# EAGLE schematic SensorBoard (EAGLE 6.5.0)

## Sheet 1 of 4
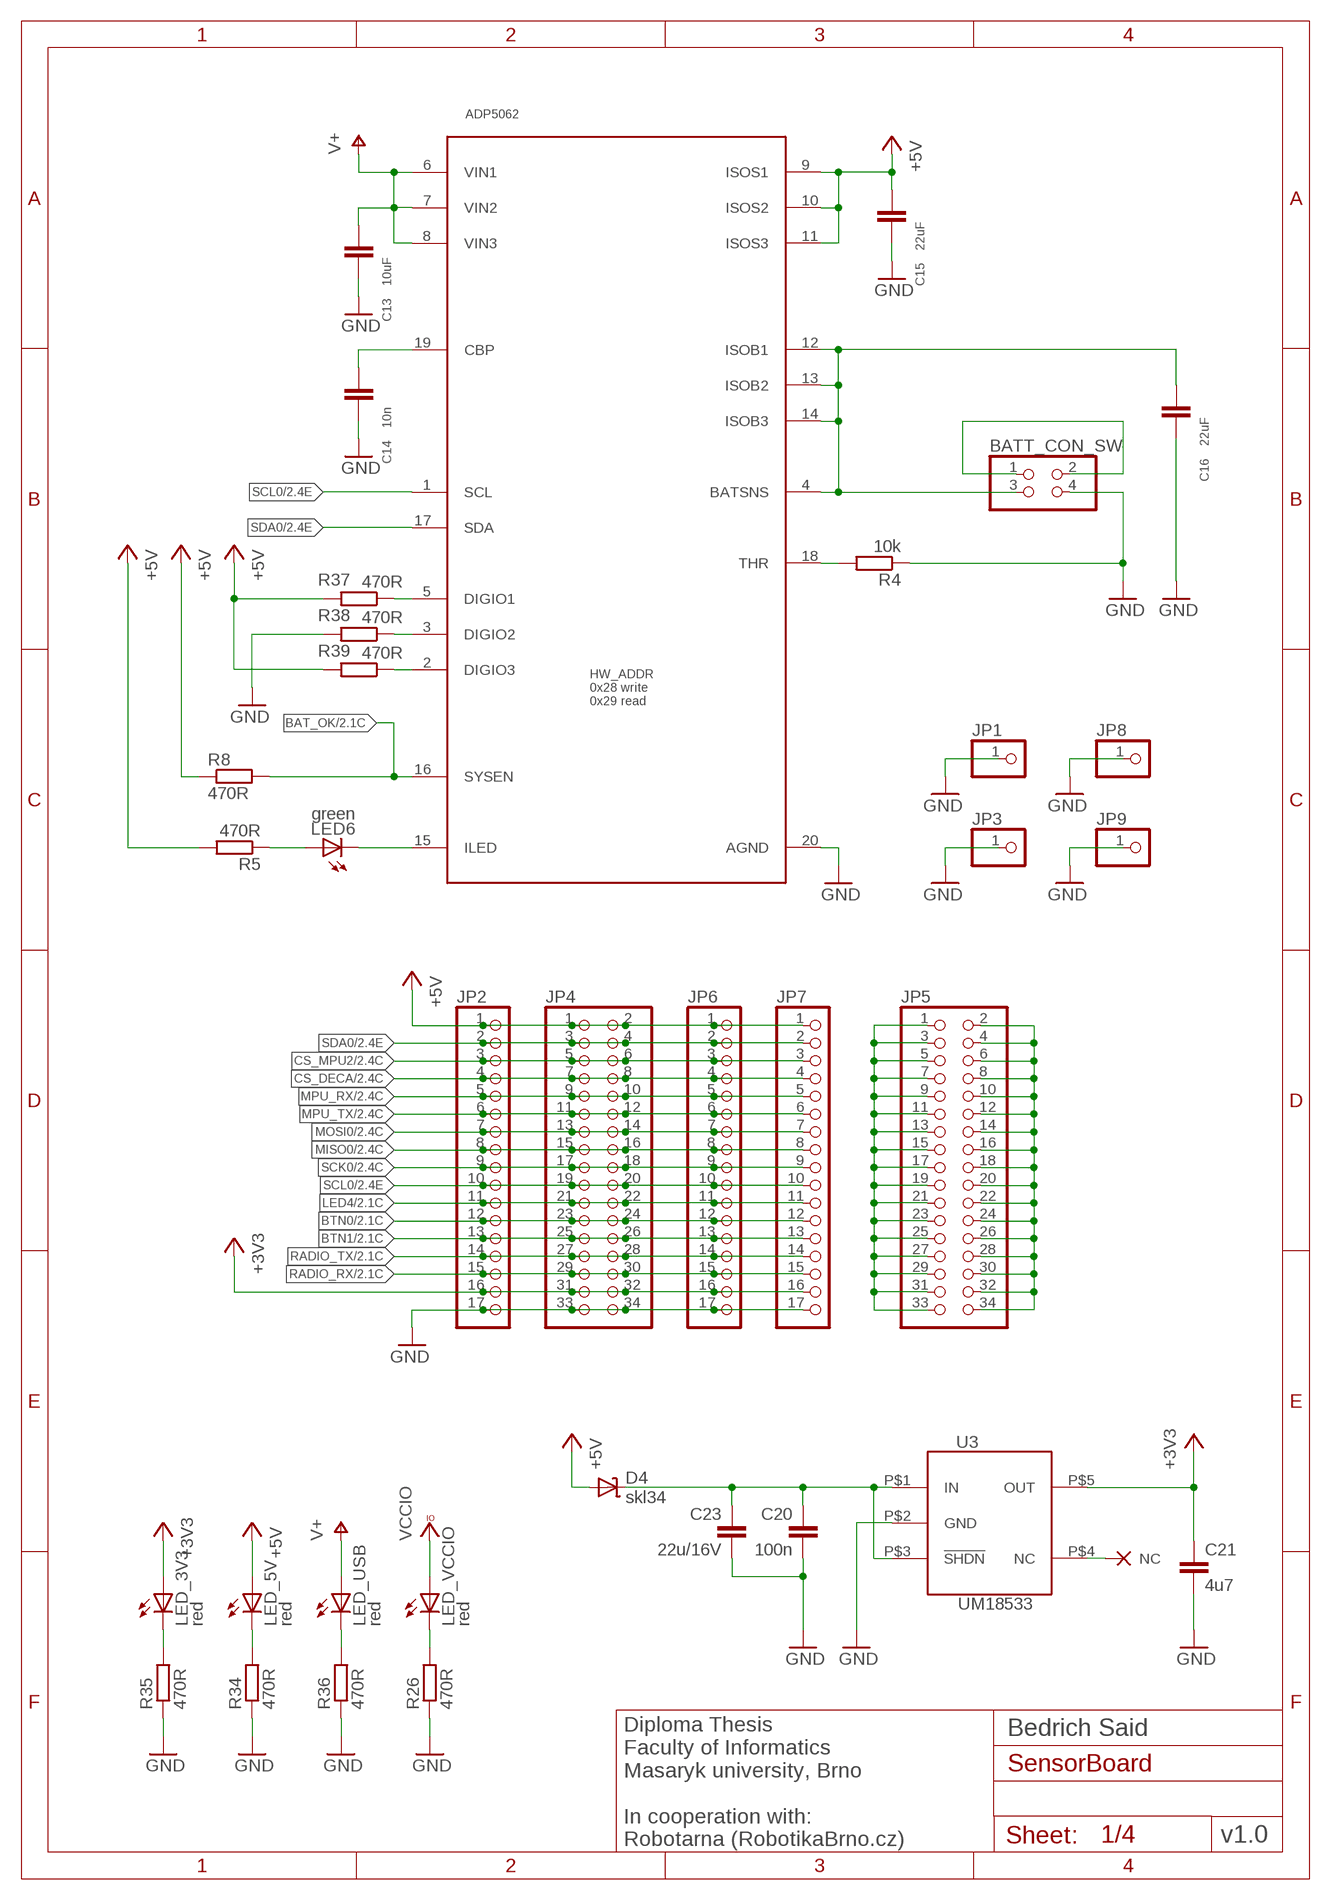
[diagram p0: schematic, sheet 1]

### Parts
BATT_CON_SW  PINHD-2X2  [2X02]
C13  10uF  C-EUC1206  [C1206]
C14  10n  C-EUC0603  [C0603]
C15  22uF  C-EUC1206  [C1206]
C16  22uF  C-EUC1206  [C1206]
C20  100n  C-EUC0603  [C0603]
C21  4u7  C-EUC0603  [C0603]
C23  22u/16V  C-EUC1206  [C1206]
CHARGER  ADP5062  [QFN50P400X400X80-21N]
D4  skl34  SHOTTKY-SOD123  [SOD123]
JP1  PINHD-1X1  [1X01]
JP2  PINHD-1X17  [1X17]
JP3  PINHD-1X1  [1X01]
JP4  PINHD-2X17  [2X17]
JP5  PINHD-2X17  [2X17]
JP6  PINHD-1X17  [1X17]
JP7  PINHD-1X17  [1X17]
JP8  PINHD-1X1  [1X01]
JP9  PINHD-1X1  [1X01]
LED6  green  LEDCHIPLED_0603  [CHIPLED_0603]
LED_3V3  red  LEDCHIPLED_0603  [CHIPLED_0603]
LED_5V  red  LEDCHIPLED_0603  [CHIPLED_0603]
LED_USB  red  LEDCHIPLED_0603  [CHIPLED_0603]
LED_VCCIO  red  LEDCHIPLED_0603  [CHIPLED_0603]
NC8  NC  (no package)
R4  10k  R-EU_R0603  [R0603]
R5  470R  R-EU_R0603  [R0603]
R8  470R  R-EU_R0603  [R0603]
R26  470R  R-EU_R0603  [R0603]
R34  470R  R-EU_R0603  [R0603]
R35  470R  R-EU_R0603  [R0603]
R36  470R  R-EU_R0603  [R0603]
R37  470R  R-EU_R0603  [R0603]
R38  470R  R-EU_R0603  [R0603]
R39  470R  R-EU_R0603  [R0603]
U3  UM18533  UM185XX  [SOT23-5]

### Nets
5V->3V3: C20.1 C23.1 D4.C U3.P$1(IN) U3.P$3(!SHDN)
+3V3: C21.1 JP2.16 JP4.31 JP4.32 JP6.16 JP7.16 LED_3V3.A U3.P$5(OUT) ; also sheet 2,3,4
+5V: C15.1 CHARGER.9(ISOS1) CHARGER.10(ISOS2) CHARGER.11(ISOS3) D4.A JP2.1 JP4.1 JP4.2 JP6.1 JP7.1 LED_5V.A R5.2 R8.1 R37.2 R39.2 ; also sheet 3
BAT_OK: CHARGER.16(SYSEN) R8.2 ; also sheet 2
BTN0: JP2.12 JP4.23 JP4.24 JP6.12 JP7.12 ; also sheet 2
BTN1: JP2.13 JP4.25 JP4.26 JP6.13 JP7.13 ; also sheet 2
CS_DECA: JP2.4 JP4.7 JP4.8 JP6.4 JP7.4 ; also sheet 2,4
CS_MPU2: JP2.3 JP4.5 JP4.6 JP6.3 JP7.3 ; also sheet 2,3
GND: BATT_CON_SW.4 C13.2 C14.2 C15.2 C16.2 C20.2 C21.2 C23.2 CHARGER.20(AGND) JP1.1 JP2.17 JP3.1 JP4.33 JP4.34 JP6.17 JP7.17 JP8.1 JP9.1 R4.1 R26.1 R34.1 R35.1 R36.1 R38.2 U3.P$2(GND) ; also sheet 2,3,4
LED4: JP2.11 JP4.21 JP4.22 JP6.11 JP7.11 ; also sheet 2
LED_3V3: LED_VCCIO.C R26.2
LED_3V3_USB: LED_USB.C R36.2
LED_3V3_USB1: LED_3V3.C R35.2
LED_3V4: LED_5V.C R34.2
MISO0: JP2.8 JP4.15 JP4.16 JP6.8 JP7.8 ; also sheet 2,3,4
MOSI0: JP2.7 JP4.13 JP4.14 JP6.7 JP7.7 ; also sheet 2,3,4
MPU_RX: JP2.5 JP4.9 JP4.10 JP6.5 JP7.5 ; also sheet 2,3
MPU_TX: JP2.6 JP4.11 JP4.12 JP6.6 JP7.6 ; also sheet 2,3
N$3: JP5.1 JP5.3 JP5.5 JP5.7 JP5.9 JP5.11 JP5.13 JP5.15 JP5.17 JP5.19 JP5.21 JP5.23 JP5.25 JP5.27 JP5.29 JP5.31 JP5.33
N$8: BATT_CON_SW.3 C16.1 CHARGER.4(BATSNS) CHARGER.12(ISOB1) CHARGER.13(ISOB2) CHARGER.14(ISOB3)
N$9: BATT_CON_SW.1 BATT_CON_SW.2
N$10: CHARGER.18(THR) R4.2
N$14: CHARGER.15(ILED) LED6.C
N$17: C14.1 CHARGER.19(CBP)
N$18: LED6.A R5.1
N$20: CHARGER.5(DIGIO1) R37.1
N$21: CHARGER.3(DIGIO2) R38.1
N$22: CHARGER.2(DIGIO3) R39.1
N$30: JP5.2 JP5.4 JP5.6 JP5.8 JP5.10 JP5.12 JP5.14 JP5.16 JP5.18 JP5.20 JP5.22 JP5.24 JP5.26 JP5.28 JP5.30 JP5.32 JP5.34
RADIO_RX: JP2.15 JP4.29 JP4.30 JP6.15 JP7.15 ; also sheet 2,3
RADIO_TX: JP2.14 JP4.27 JP4.28 JP6.14 JP7.14 ; also sheet 2,3
SCK0: JP2.9 JP4.17 JP4.18 JP6.9 JP7.9 ; also sheet 2,3,4
SCL0: CHARGER.1(SCL) JP2.10 JP4.19 JP4.20 JP6.10 JP7.10 ; also sheet 2,3
SDA0: CHARGER.17(SDA) JP2.2 JP4.3 JP4.4 JP6.2 JP7.2 ; also sheet 2,3
U2_NC1: NC8.NC U3.P$4(NC)
V+: C13.1 CHARGER.6(VIN1) CHARGER.7(VIN2) CHARGER.8(VIN3) LED_USB.A ; also sheet 2
VCCIO: LED_VCCIO.A ; also sheet 2

### Notes on the sheet
- HW_ADDR
  0x28 write
  0x29 read
- Bedrich Said
- v1.0
- Diploma Thesis
  Faculty of Informatics
  Masaryk university, Brno
  
  In cooperation with:
  Robotarna (RobotikaBrno.cz)

## Sheet 2 of 4
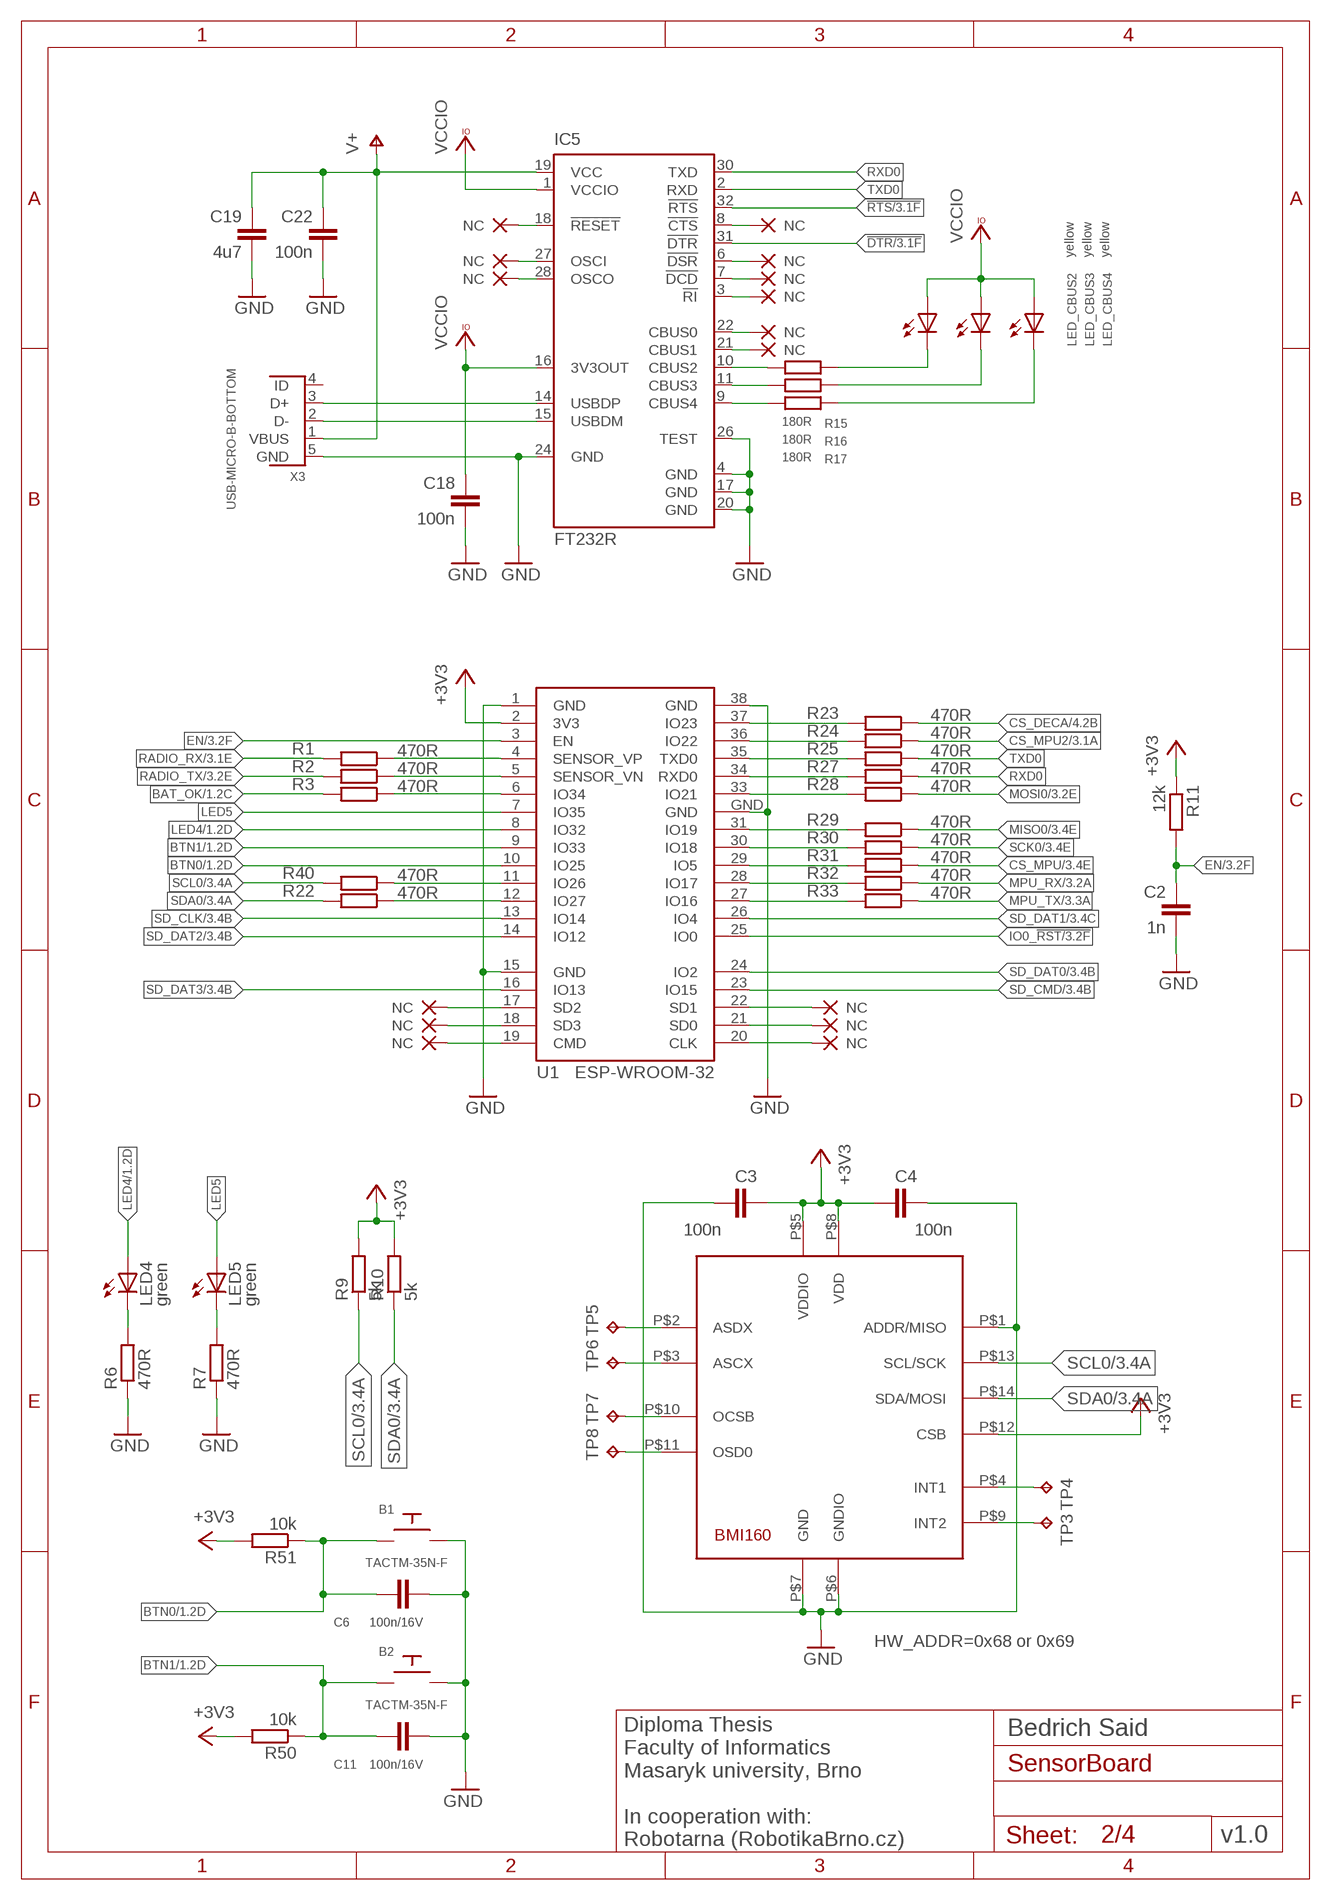
[diagram p1: schematic, sheet 2]

### Parts
B1  TACTM-35N-F  [TACTM-35N-F]
B2  TACTM-35N-F  [TACTM-35N-F]
C2  1n  C-EUC0603  [C0603]
C3  100n  C-EUC0603  [C0603]
C4  100n  C-EUC0603  [C0603]
C6  100n/16V  C-EUC0603  [C0603]
C11  100n/16V  C-EUC0603  [C0603]
C18  100n  C-EUC0603  [C0603]
C19  4u7  C-EUC0603  [C0603]
C22  100n  C-EUC0603  [C0603]
IC5  FT232R  [QFN32_LONG_PADS]
LED4  green  LEDCHIPLED_0603  [CHIPLED_0603]
LED5  green  LEDCHIPLED_0603  [CHIPLED_0603]
LED_CBUS2  yellow  LEDCHIP-LED0603  [CHIP-LED0603]
LED_CBUS3  yellow  LEDCHIP-LED0603  [CHIP-LED0603]
LED_CBUS4  yellow  LEDCHIP-LED0603  [CHIP-LED0603]
NC1  NC  (no package)
NC2  NC  (no package)
NC4  NC  (no package)
NC5  NC  (no package)
NC6  NC  (no package)
NC7  NC  (no package)
NC10  NC  (no package)
NC11  NC  (no package)
NC12  NC  (no package)
NC13  NC  (no package)
NC14  NC  (no package)
NC15  NC  (no package)
NC16  NC  (no package)
NC37  NC  (no package)
NC38  NC  (no package)
R1  470R  R-EU_R0603  [R0603]
R2  470R  R-EU_R0603  [R0603]
R3  470R  R-EU_R0603  [R0603]
R6  470R  R-EU_R0603  [R0603]
R7  470R  R-EU_R0603  [R0603]
R9  5k  R-EU_R0603  [R0603]
R10  5k  R-EU_R0603  [R0603]
R11  12k  R-EU_R0603  [R0603]
R15  180R  R-EU_R0603  [R0603]
R16  180R  R-EU_R0603  [R0603]
R17  180R  R-EU_R0603  [R0603]
R22  470R  R-EU_R0603  [R0603]
R23  470R  R-EU_R0603  [R0603]
R24  470R  R-EU_R0603  [R0603]
R25  470R  R-EU_R0603  [R0603]
R27  470R  R-EU_R0603  [R0603]
R28  470R  R-EU_R0603  [R0603]
R29  470R  R-EU_R0603  [R0603]
R30  470R  R-EU_R0603  [R0603]
R31  470R  R-EU_R0603  [R0603]
R32  470R  R-EU_R0603  [R0603]
R33  470R  R-EU_R0603  [R0603]
R40  470R  R-EU_R0603  [R0603]
R50  10k  R-EU_R0603  [R0603]
R51  10k  R-EU_R0603  [R0603]
TP3  TPTP08SQ  [TP08SQ]
TP4  TPTP08SQ  [TP08SQ]
TP5  TPTP08SQ  [TP08SQ]
TP6  TPTP08SQ  [TP08SQ]
TP7  TPTP08SQ  [TP08SQ]
TP8  TPTP08SQ  [TP08SQ]
U1  ESP-WROOM-32  [ESP-WROOM-32]
U$3  BMI160LGA14  [LGA14-BMI160]
X3  USB-MICRO-B-BOTTOM  [USB-MICRO-B-BOTTOM-MOLEX]

### Nets
!DTR: IC5.31(!DTR) ; also sheet 3
!RTS: IC5.32(!RTS) ; also sheet 3
+3V3: C3.2 C4.1 R9.2 R10.2 R11.1 R50.2 R51.2 U1.2(3V3) U$3.P$5(VDDIO) U$3.P$8(VDD) U$3.P$12(CSB) ; also sheet 1,3,4
BAT_OK: R3.2 ; also sheet 1
BTN0: B1.P$4 C6.2 R51.1 U1.10(IO25) ; also sheet 1
BTN1: B2.P$4 C11.2 R50.1 U1.9(IO33) ; also sheet 1
CBUS2: IC5.10(CBUS2) R15.2
CBUS2_LED: LED_CBUS2.C R15.1
CBUS3: IC5.11(CBUS3) R16.2
CBUS3_LED: LED_CBUS3.C R16.1
CBUS4: IC5.9(CBUS4) R17.2
CBUS4_LED: LED_CBUS4.C R17.1
CS_DECA: R23.1 ; also sheet 1,4
CS_MPU: R31.1 ; also sheet 3
CS_MPU2: R24.1 ; also sheet 1,3
EN: C2.1 R11.2 U1.3(EN) ; also sheet 3
GND: B1.P$2 B2.P$2 C2.2 C3.1 C4.2 C6.1 C11.1 C18.2 C19.2 C22.2 IC5.4(GND) IC5.17(GND) IC5.20(GND) IC5.24(GND) IC5.26(TEST) R6.1 R7.1 U1.1(GND) U1.15(GND) U1.38(GND) U1.GND U$3.P$1(ADDR/MISO) U$3.P$6(GNDIO) U$3.P$7(GND) X3.5(GND) ; also sheet 1,3,4
IO0_!RST: U1.25(IO0) ; also sheet 3
IO5: R31.2 U1.29(IO5)
IO16: R33.2 U1.27(IO16)
IO17: R32.2 U1.28(IO17)
IO18: R30.2 U1.30(IO18)
IO19: R29.2 U1.31(IO19)
IO21: R28.2 U1.33(IO21)
IO22: R24.2 U1.36(IO22)
IO23: R23.2 U1.37(IO23)
IO26: R40.1 U1.11(IO26)
IO27: R22.1 U1.12(IO27)
IO34: R3.1 U1.6(IO34)
LED4: LED4.A U1.8(IO32) ; also sheet 1
LED5: LED5.A U1.7(IO35)
LED_3V1: LED4.C R6.2
LED_3V2: LED5.C R7.2
MISO0: R29.1 ; also sheet 1,3,4
MOSI0: R28.1 ; also sheet 1,3,4
MPU_RX: R32.1 ; also sheet 1,3
MPU_TX: R33.1 ; also sheet 1,3
N$11: IC5.18(!RESET) NC10.NC
N$12: IC5.8(!CTS) NC11.NC
N$13: IC5.6(!DSR) NC12.NC
N$23: IC5.7(!DCD) NC13.NC
N$25: IC5.3(!RI) NC14.NC
N$26: IC5.22(CBUS0) NC15.NC
N$27: IC5.21(CBUS1) NC16.NC
N$35: NC5.NC U1.17(SD2)
N$36: NC6.NC U1.18(SD3)
N$37: NC7.NC U1.19(CMD)
N$38: NC1.NC U1.22(SD1)
N$39: NC2.NC U1.21(SD0)
N$40: NC4.NC U1.20(CLK)
N$61: TP5.TP U$3.P$2(ASDX)
N$62: TP6.TP U$3.P$3(ASCX)
N$63: TP7.TP U$3.P$10(OCSB)
N$64: TP8.TP U$3.P$11(OSD0)
N$65: TP4.TP U$3.P$4(INT1)
N$66: TP3.TP U$3.P$9(INT2)
N$68: IC5.27(OSCI) NC37.NC
N$69: IC5.28(OSCO) NC38.NC
RADIO_RX: R1.2 ; also sheet 1,3
RADIO_TX: R2.2 ; also sheet 1,3
RXD0: IC5.30(TXD) R27.1
RXD0_: R27.2 U1.34(RXD0)
SCK0: R30.1 ; also sheet 1,3,4
SCL0: R9.1 R40.2 U$3.P$13(SCL/SCK) ; also sheet 1,3
SD_CLK: U1.13(IO14) ; also sheet 3
SD_CMD: U1.23(IO15) ; also sheet 3
SD_DAT0: U1.24(IO2) ; also sheet 3
SD_DAT1: U1.26(IO4) ; also sheet 3
SD_DAT2: U1.14(IO12) ; also sheet 3
SD_DAT3: U1.16(IO13) ; also sheet 3
SDA0: R10.1 R22.2 U$3.P$14(SDA/MOSI) ; also sheet 1,3
SENSOR_VN_: R2.1 U1.5(SENSOR_VN)
SENSOR_VP_: R1.1 U1.4(SENSOR_VP)
TXD0: IC5.2(RXD) R25.1
TXD0_: R25.2 U1.35(TXD0)
USBDM: IC5.15(USBDM) X3.2(D-)
USBDP: IC5.14(USBDP) X3.3(D+)
V+: C19.1 C22.1 IC5.19(VCC) X3.1(VBUS) ; also sheet 1
VCCIO: C18.1 IC5.1(VCCIO) IC5.16(3V3OUT) LED_CBUS2.A LED_CBUS3.A LED_CBUS4.A ; also sheet 1
Unconnected: X3.4(ID)

### Notes on the sheet
- HW_ADDR=0x68 or 0x69
- Bedrich Said
- v1.0
- Diploma Thesis
  Faculty of Informatics
  Masaryk university, Brno
  
  In cooperation with:
  Robotarna (RobotikaBrno.cz)

## Sheet 3 of 4
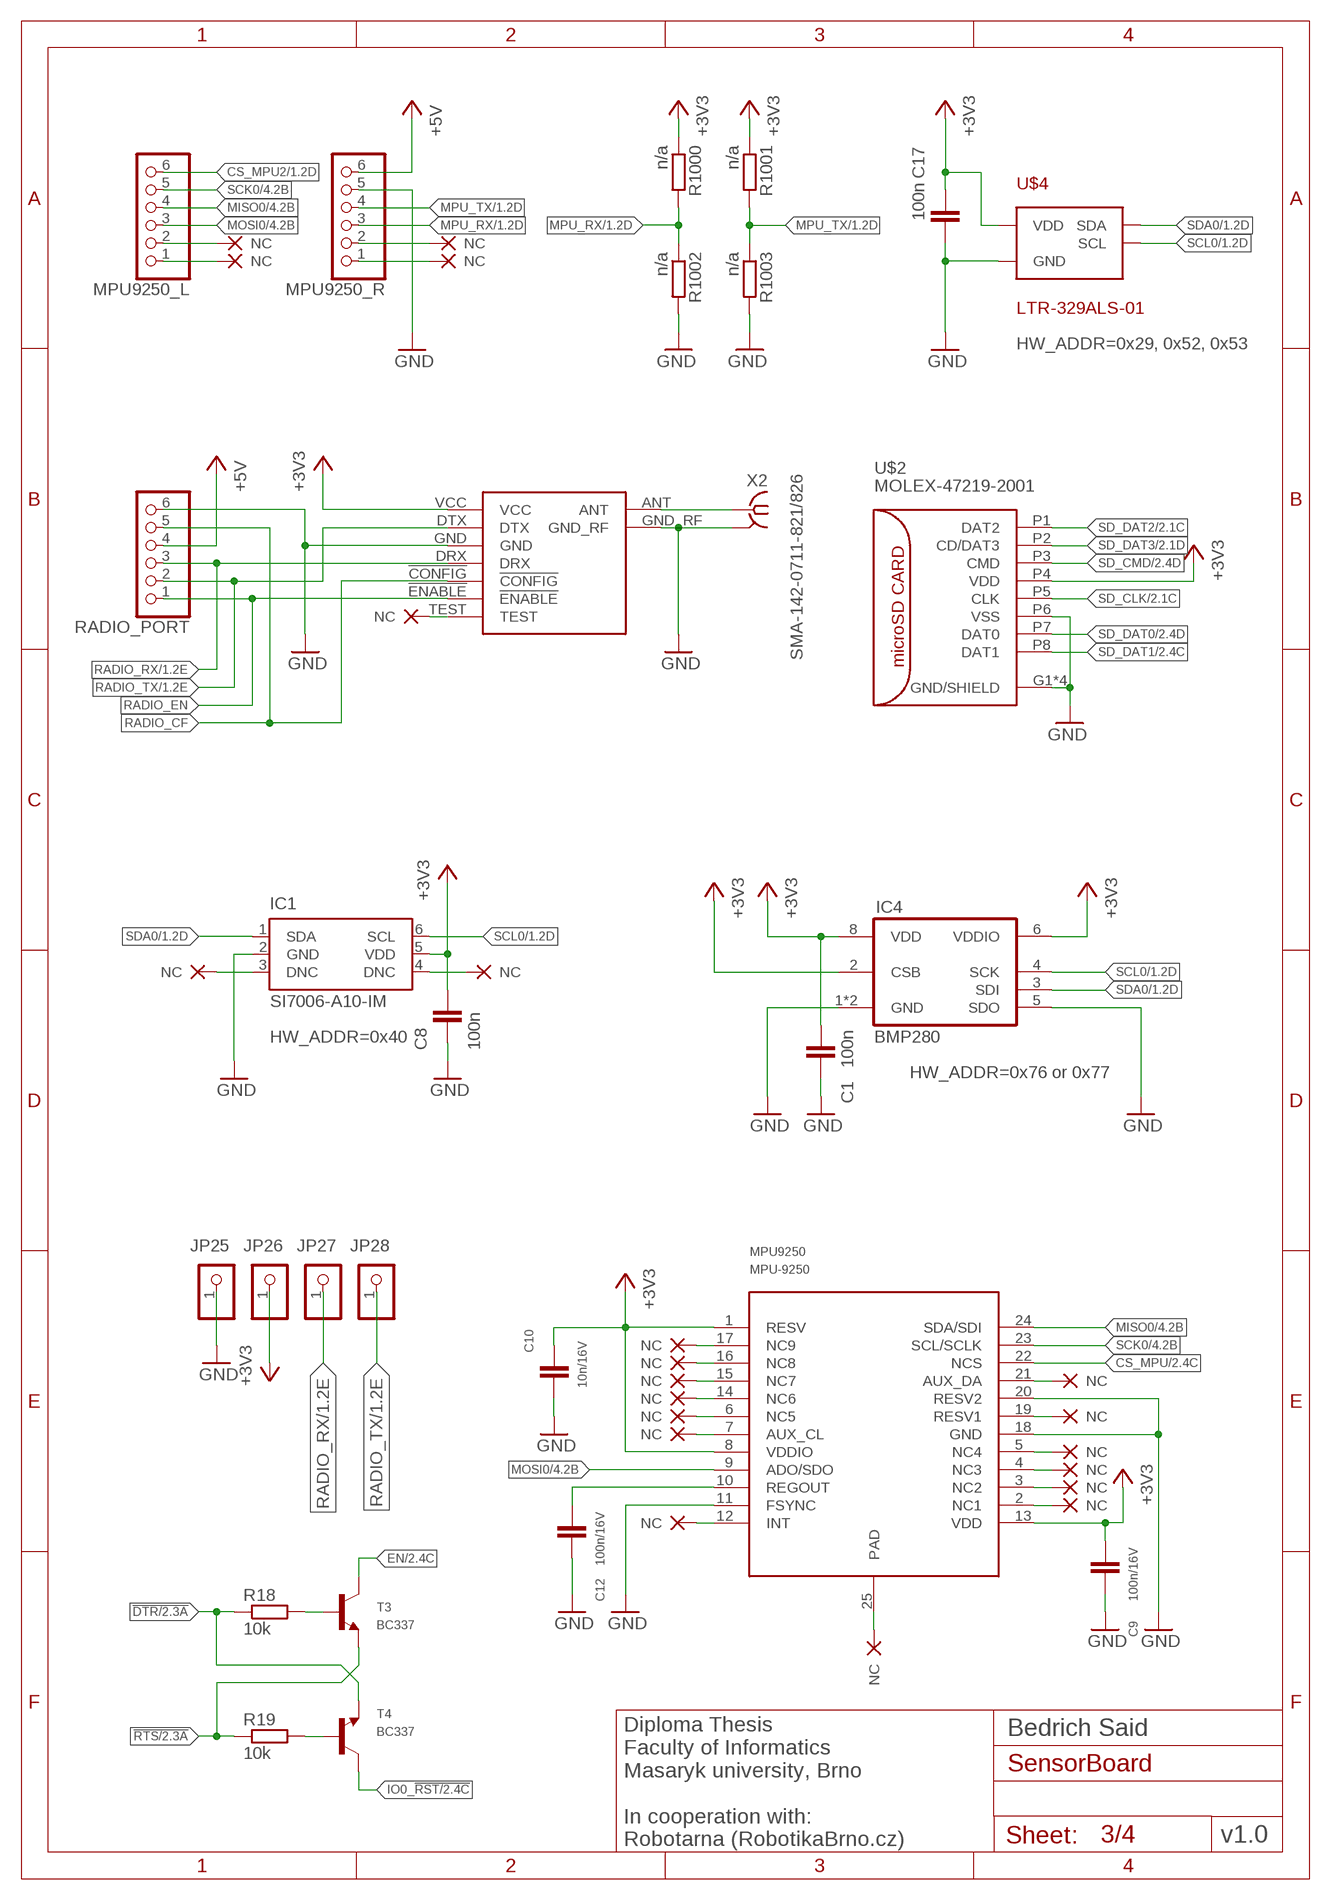
[diagram p2: schematic, sheet 3]

### Parts
C1  100n  C-EUC0603  [C0603]
C8  100n  C-EUC0603  [C0603]
C9  100n/16V  C-EUC0603  [C0603]
C10  10n/16V  C-EUC0603  [C0603]
C12  100n/16V  C-EUC0603  [C0603]
C17  100n  C-EUC0603  [C0603]
IC1  SI7006-A10-IM  [DFN6-3X3]
IC4  BMP280  [BMP280]
JP25  PINHD-1X1  [1X01]
JP26  PINHD-1X1  [1X01]
JP27  PINHD-1X1  [1X01]
JP28  PINHD-1X1  [1X01]
MPU9250  MPU-9250  [LEAD-QFN24]
MPU9250_L  PINHD-1X6  [1X06]
MPU9250_R  PINHD-1X6  [1X06]
NC3  NC  (no package)
NC9  NC  (no package)
NC17  NC  (no package)
NC18  NC  (no package)
NC19  NC  (no package)
NC20  NC  (no package)
NC21  NC  (no package)
NC22  NC  (no package)
NC23  NC  (no package)
NC24  NC  (no package)
NC25  NC  (no package)
NC26  NC  (no package)
NC27  NC  (no package)
NC28  NC  (no package)
NC29  NC  (no package)
NC30  NC  (no package)
NC31  NC  (no package)
NC33  NC  (no package)
NC34  NC  (no package)
NC35  NC  (no package)
NC36  NC  (no package)
R18  10k  R-EU_R0603  [R0603]
R19  10k  R-EU_R0603  [R0603]
R1000  n/a  R-EU_R0603  [R0603]
R1001  n/a  R-EU_R0603  [R0603]
R1002  n/a  R-EU_R0603  [R0603]
R1003  n/a  R-EU_R0603  [R0603]
RADIO_PORT  PINHD-1X6  [1X06]
T3  BC337  NPN-SOT23-BEC  [SOT23]
T4  BC337  NPN-SOT23-BEC  [SOT23]
U$1  HM-TRP  [HM-TRP]
U$2  MOLEX-47219-2001  [MOLEX:47219-2001]
U$4  LTR-329ALS-01  [CHIPLED-4]
X2  SMA-142-0711-821/826  [J502-ND-142-0711-821/826]

### Nets
!DTR: R18.1 T4.2(E) ; also sheet 2
!DTR_B: R18.2 T3.1(B)
!RTS: R19.1 T3.2(E) ; also sheet 2
!RTS_B: R19.2 T4.1(B)
+3V3: C1.1 C8.1 C9.1 C10.1 C17.2 IC1.5(VDD) IC4.2(CSB) IC4.6(VDDIO) IC4.8(VDD) JP26.1 MPU9250.1(RESV) MPU9250.8(VDDIO) MPU9250.13(VDD) R1000.1 R1001.1 U$1.VCC U$2.P4(VDD) U$4.1(VDD) ; also sheet 1,2,4
+5V: MPU9250_R.6 RADIO_PORT.4 ; also sheet 1
CS_MPU: MPU9250.22(NCS) ; also sheet 2
CS_MPU2: MPU9250_L.6 ; also sheet 1,2
EN: T3.3(C) ; also sheet 2
GND: C1.2 C8.2 C9.2 C10.2 C12.2 C17.1 IC1.2(GND) IC4.1(GND) IC4.5(SDO) IC4.7(GND) JP25.1 MPU9250.11(FSYNC) MPU9250.18(GND) MPU9250.20(RESV2) MPU9250_R.5 R1002.2 R1003.2 RADIO_PORT.6 U$1.GND U$1.GND_RF U$2.G1(GND/SHIELD) U$2.G2(GND/SHIELD) U$2.G3(GND/SHIELD) U$2.G4(GND/SHIELD) U$2.P6(VSS) U$4.2(GND) X2.G@1 X2.G@2 X2.G@3 X2.G@4 ; also sheet 1,2,4
IO0_!RST: T4.3(C) ; also sheet 2
MISO0: MPU9250.24(SDA/SDI) MPU9250_L.4 ; also sheet 1,2,4
MOSI0: MPU9250.9(ADO/SDO) MPU9250_L.3 ; also sheet 1,2,4
MPU_RX: MPU9250_R.3 R1000.2 R1002.1 ; also sheet 1,2
MPU_TX: MPU9250_R.4 R1001.2 R1003.1 ; also sheet 1,2
N$1: MPU9250.12(INT) NC30.NC
N$2: MPU9250.25(PAD) NC29.NC
N$4: IC1.3(DNC) NC9.NC
N$5: C12.1 MPU9250.10(REGOUT)
N$6: MPU9250_R.1 NC36.NC
N$7: IC1.4(DNC) NC3.NC
N$16: U$1.ANT X2.1
N$19: MPU9250.17(NC9) NC17.NC
N$24: MPU9250_R.2 NC35.NC
N$28: MPU9250.16(NC8) NC18.NC
N$29: MPU9250.15(NC7) NC19.NC
N$41: MPU9250.14(NC6) NC20.NC
N$42: MPU9250.6(NC5) NC21.NC
N$43: MPU9250.7(AUX_CL) NC22.NC
N$44: MPU9250.21(AUX_DA) NC23.NC
N$45: MPU9250.2(NC1) NC28.NC
N$46: MPU9250.3(NC2) NC27.NC
N$47: MPU9250.4(NC3) NC26.NC
N$48: MPU9250.5(NC4) NC25.NC
N$49: MPU9250.19(RESV1) NC24.NC
N$50: MPU9250_L.2 NC33.NC
N$51: MPU9250_L.1 NC34.NC
N$98: NC31.NC U$1.TEST
RADIO_CF: RADIO_PORT.5 U$1.!CONFIG
RADIO_EN: RADIO_PORT.1 U$1.!ENABLE
RADIO_RX: JP27.1 RADIO_PORT.3 U$1.DRX ; also sheet 1,2
RADIO_TX: JP28.1 RADIO_PORT.2 U$1.DTX ; also sheet 1,2
SCK0: MPU9250.23(SCL/SCLK) MPU9250_L.5 ; also sheet 1,2,4
SCL0: IC1.6(SCL) IC4.4(SCK) U$4.4(SCL) ; also sheet 1,2
SD_CLK: U$2.P5(CLK) ; also sheet 2
SD_CMD: U$2.P3(CMD) ; also sheet 2
SD_DAT0: U$2.P7(DAT0) ; also sheet 2
SD_DAT1: U$2.P8(DAT1) ; also sheet 2
SD_DAT2: U$2.P1(DAT2) ; also sheet 2
SD_DAT3: U$2.P2(CD/DAT3) ; also sheet 2
SDA0: IC1.1(SDA) IC4.3(SDI) U$4.3(SDA) ; also sheet 1,2

### Notes on the sheet
- HW_ADDR=0x29, 0x52, 0x53
- HW_ADDR=0x40
- HW_ADDR=0x76 or 0x77
- Bedrich Said
- v1.0
- Diploma Thesis
  Faculty of Informatics
  Masaryk university, Brno
  
  In cooperation with:
  Robotarna (RobotikaBrno.cz)

## Sheet 4 of 4
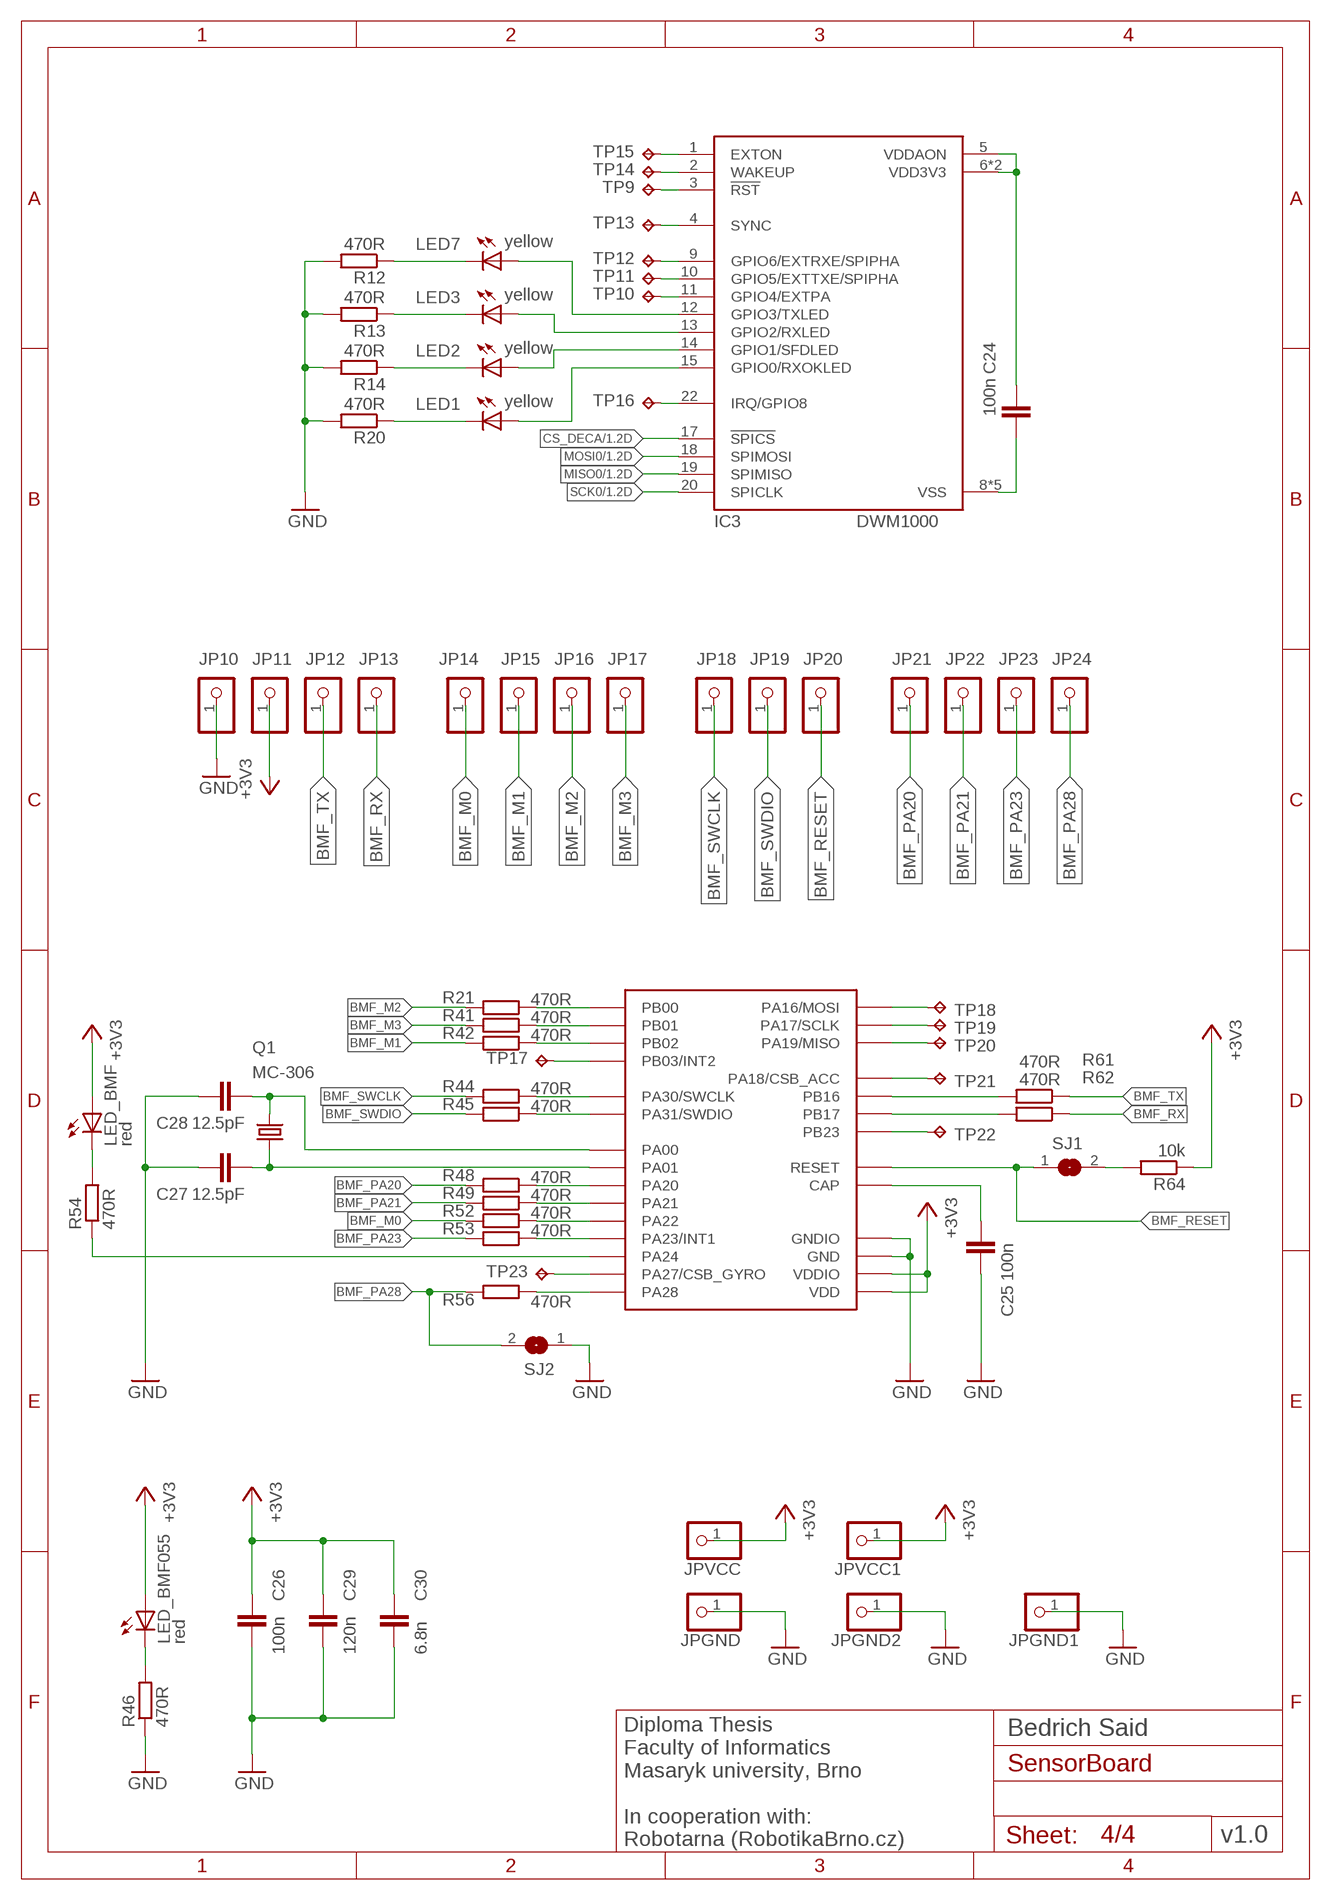
[diagram p3: schematic, sheet 4]

### Parts
C24  100n  C-EUC0603  [C0603]
C25  100n  C-EUC0603  [C0603]
C26  100n  C-EUC0603  [C0603]
C27  12.5pF  C-EUC0603  [C0603]
C28  12.5pF  C-EUC0603  [C0603]
C29  120n  C-EUC0603  [C0603]
C30  6.8n  C-EUC0603  [C0603]
IC3  DWM1000  [DWM1000]
JP10  PINHD-1X1  [1X01]
JP11  PINHD-1X1  [1X01]
JP12  PINHD-1X1  [1X01]
JP13  PINHD-1X1  [1X01]
JP14  PINHD-1X1  [1X01]
JP15  PINHD-1X1  [1X01]
JP16  PINHD-1X1  [1X01]
JP17  PINHD-1X1  [1X01]
JP18  PINHD-1X1  [1X01]
JP19  PINHD-1X1  [1X01]
JP20  PINHD-1X1  [1X01]
JP21  PINHD-1X1  [1X01]
JP22  PINHD-1X1  [1X01]
JP23  PINHD-1X1  [1X01]
JP24  PINHD-1X1  [1X01]
JPGND  PINHD-1X1  [1X01]
JPGND1  PINHD-1X1  [1X01]
JPGND2  PINHD-1X1  [1X01]
JPVCC  PINHD-1X1  [1X01]
JPVCC1  PINHD-1X1  [1X01]
LED1  yellow  LEDCHIPLED_0603  [CHIPLED_0603]
LED2  yellow  LEDCHIPLED_0603  [CHIPLED_0603]
LED3  yellow  LEDCHIPLED_0603  [CHIPLED_0603]
LED7  yellow  LEDCHIPLED_0603  [CHIPLED_0603]
LED_BMF  red  LEDCHIPLED_0603  [CHIPLED_0603]
LED_BMF055  red  LEDCHIPLED_0603  [CHIPLED_0603]
Q1  MC-306  [MC-306]
R12  470R  R-EU_R0603  [R0603]
R13  470R  R-EU_R0603  [R0603]
R14  470R  R-EU_R0603  [R0603]
R20  470R  R-EU_R0603  [R0603]
R21  470R  R-EU_R0603  [R0603]
R41  470R  R-EU_R0603  [R0603]
R42  470R  R-EU_R0603  [R0603]
R44  470R  R-EU_R0603  [R0603]
R45  470R  R-EU_R0603  [R0603]
R46  470R  R-EU_R0603  [R0603]
R48  470R  R-EU_R0603  [R0603]
R49  470R  R-EU_R0603  [R0603]
R52  470R  R-EU_R0603  [R0603]
R53  470R  R-EU_R0603  [R0603]
R54  470R  R-EU_R0603  [R0603]
R56  470R  R-EU_R0603  [R0603]
R61  470R  R-EU_R0603  [R0603]
R62  470R  R-EU_R0603  [R0603]
R64  10k  R-EU_R0603  [R0603]
SJ1  SJ  [SJ]
SJ2  SJ  [SJ]
TP9  TPTP15SQ  [TP15SQ]
TP10  TPTP15SQ  [TP15SQ]
TP11  TPTP15SQ  [TP15SQ]
TP12  TPTP15SQ  [TP15SQ]
TP13  TPTP15SQ  [TP15SQ]
TP14  TPTP15SQ  [TP15SQ]
TP15  TPTP15SQ  [TP15SQ]
TP16  TPTP20SQ  [TP20SQ]
TP17  TPTP08SQ  [TP08SQ]
TP18  TPTP08SQ  [TP08SQ]
TP19  TPTP08SQ  [TP08SQ]
TP20  TPTP08SQ  [TP08SQ]
TP21  TPTP08SQ  [TP08SQ]
TP22  TPTP15SQ  [TP15SQ]
TP23  TPTP15SQ  [TP15SQ]
U$5  BMF055  [LGA-28]

### Nets
+3V3: C26.1 C29.1 C30.1 JP11.1 JPVCC1.1 JPVCC.1 LED_BMF055.A LED_BMF.A R64.1 U$5.P$3(VDD) U$5.P$28(VDDIO) ; also sheet 1,2,3
BMF_M0: JP14.1 R52.2
BMF_M1: JP15.1 R42.2
BMF_M2: JP16.1 R21.2
BMF_M3: JP17.1 R41.2
BMF_PA20: JP21.1 R48.2
BMF_PA21: JP22.1 R49.2
BMF_PA23: JP23.1 R53.2
BMF_PA28: JP24.1 R56.2 SJ2.2
BMF_RESET: JP20.1 SJ1.1 U$5.P$11(RESET)
BMF_RX: JP13.1 R62.1
BMF_SWCLK: JP18.1 R44.2
BMF_SWDIO: JP19.1 R45.2
BMF_TX: JP12.1 R61.1
CS_DECA: IC3.17(!SPICS) ; also sheet 1,2
GND: C25.2 C26.2 C27.2 C28.2 C29.2 C30.2 JP10.1 JPGND1.1 JPGND2.1 JPGND.1 R12.2 R13.2 R14.2 R20.2 R46.1 SJ2.1 U$5.P$2(GND) U$5.P$25(GNDIO) ; also sheet 1,2,3
LED_3V3_USB2: LED_BMF055.C R46.2
MISO0: IC3.19(SPIMISO) ; also sheet 1,2,3
MOSI0: IC3.18(SPIMOSI) ; also sheet 1,2,3
N$15: R21.1 U$5.P$6(PB00)
N$33: LED1.C R20.1
N$34: LED2.C R14.1
N$52: LED3.C R13.1
N$53: IC3.22(IRQ/GPIO8) TP16.TP
N$54: R41.1 U$5.P$5(PB01)
N$55: C24.1 IC3.8(VSS) IC3.16(VSS) IC3.21(VSS) IC3.23(VSS) IC3.24(VSS)
N$56: C24.2 IC3.5(VDDAON) IC3.6(VDD3V3) IC3.7(VDD3V3)
N$57: R42.1 U$5.P$4(PB02)
N$58: LED7.C R12.1
N$59: IC3.12(GPIO3/TXLED) LED7.A
N$60: IC3.13(GPIO2/RXLED) LED3.A
N$67: IC3.14(GPIO1/SFDLED) LED2.A
N$70: IC3.15(GPIO0/RXOKLED) LED1.A
N$71: IC3.11(GPIO4/EXTPA) TP10.TP
N$72: IC3.3(!RST) TP9.TP
N$73: IC3.10(GPIO5/EXTTXE/SPIPHA) TP11.TP
N$74: IC3.9(GPIO6/EXTRXE/SPIPHA) TP12.TP
N$75: IC3.4(SYNC) TP13.TP
N$76: IC3.2(WAKEUP) TP14.TP
N$77: IC3.1(EXTON) TP15.TP
N$78: TP17.TP U$5.P$1(PB03/INT2)
N$79: R44.1 U$5.P$8(PA30/SWCLK)
N$80: R45.1 U$5.P$7(PA31/SWDIO)
N$81: C28.1 Q1.4 U$5.P$27(PA00)
N$82: C27.1 Q1.1 U$5.P$26(PA01)
N$83: R48.1 U$5.P$18(PA20)
N$84: R49.1 U$5.P$17(PA21)
N$85: R52.1 U$5.P$16(PA22)
N$86: R53.1 U$5.P$15(PA23/INT1)
N$87: R54.1 U$5.P$14(PA24)
N$88: TP23.TP U$5.P$12(PA27/CSB_GYRO)
N$89: R56.1 U$5.P$10(PA28)
N$90: TP18.TP U$5.P$24(PA16/MOSI)
N$91: TP19.TP U$5.P$23(PA17/SCLK)
N$92: TP20.TP U$5.P$21(PA19/MISO)
N$93: TP21.TP U$5.P$22(PA18/CSB_ACC)
N$94: R61.2 U$5.P$20(PB16)
N$95: R62.2 U$5.P$19(PB17)
N$96: TP22.TP U$5.P$13(PB23)
N$97: LED_BMF.C R54.2
N$99: C25.1 U$5.P$9(CAP)
N$100: R64.2 SJ1.2
SCK0: IC3.20(SPICLK) ; also sheet 1,2,3

### Notes on the sheet
- Bedrich Said
- v1.0
- Diploma Thesis
  Faculty of Informatics
  Masaryk university, Brno
  
  In cooperation with:
  Robotarna (RobotikaBrno.cz)

## Library data of the parts
B1 B2 = TACTM-35N-F:TACTM-35N-F
BATT_CON_SW = pinhead:PINHD-2X2: PIN HEADER
C1-C4 C6 C8-C30 = rcl_upravena:C-EU: CAPACITOR, European symbol
CHARGER = OMAT_IC:ADP5062
D4 = diode:SHOTTKY
IC1 = si70xx:SI7006-*: I2C Humidity and Temperature Sensor Source: http://www.silabs.com/Support%20Documents/TechnicalDocs/Si7006-A10.pdf; MF: Silicon Labs; MPN: Si7006-A10-IM; OC_FARNELL: unknown; OC_NEWARK: unknown
IC3 = decawave:DWM1000
IC4 = bosch-bmp280:BMP280: The BMP280 is an absolute barometric pressure sensor especially designed for mobile applications. The sensor module is housed in an extremely compact 8-pin metal-lid LGA package with a footprint of only 2.0 × 2.5 mm2 and 0.95 mm package height. Its small dimensions and its low power consumption of 2.7 μA @1Hz allow the implementation in battery driven devices such as mobile phones, GPS modules or watches. The library has been designed by Richard Magdycz <https://www.facebook.com/groups/eaglecadsoftUK>
IC5 = ftdichip_upravena:FT232R: Source: http://www.ftdichip.com/Documents/DataSheets/DS_FT232R_v104.pdf
JP1 JP3 JP8-JP28 JPGND JPGND1 JPGND2 JPVCC JPVCC1 = pinhead:PINHD-1X1: PIN HEADER
JP2 JP6 JP7 = pinhead:PINHD-1X17: PIN HEADER
JP4 JP5 = pinhead:PINHD-2X17: PIN HEADER
LED1-LED7 LED_3V3 LED_5V LED_BMF LED_BMF055 LED_CBUS2-LED_CBUS4 LED_USB LED_VCCIO = led:LED: LED OSRAM: - CHIPLED LG R971, LG N971, LY N971, LG Q971, LY Q971, LO R971, LY R971 LH N974, LH R974 LS Q976, LO Q976, LY Q976 LO Q996 - Hyper CHIPLED LW Q18S LB Q993, LB Q99A, LB R99A - SideLED LS A670, LO A670, LY A670, LG A670, LP A670 LB A673, LV A673, LT A673, LW A673 LH A674 LY A675 LS A676, LA A676, LO A676, LY A676, LW A676 LS A679, LY A679, LG A679 - Hyper Micro SIDELED® LS Y876, LA Y876, LO Y876, LY Y876 LT Y87S - SmartLED LW L88C, LW L88S LB L89C, LB L89S, LG L890 LS L89K, LO L89K, LY L89K LS L896, LA L896, LO L896, LY L896 - TOPLED LS T670, LO T670, LY T670, LG T670, LP T670 LSG T670, LSP T670, LSY T670, LOP T670, LYG T670 LG T671, LOG T671, LSG T671 LB T673, LV T673, LT T673, LW T673 LH T674 LS T676, LA T676, LO T676, LY T676, LB T676, LH T676, LSB T676, LW T676 LB T67C, LV T67C, LT T67C, LS T67K, LO T67K, LY T67K, LW E67C LS E67B, LA E67B, LO E67B, LY E67B, LB E67C, LV E67C, LT E67C LW T67C LS T679, LY T679, LG T679 LS T770, LO T770, LY T770, LG T770, LP T770 LB T773, LV T773, LT T773, LW T773 LH T774 LS E675, LA E675, LY E675, LS T675 LS T776, LA T776, LO T776, LY T776, LB T776 LHGB T686 LT T68C, LB T68C - Hyper Mini TOPLED® LB M676 - Mini TOPLED Santana® LG M470 LS M47K, LO M47K, LY M47K Source: http://www.osram.convergy.de LUXEON: - LUMILED® LXK2-PW12-R00, LXK2-PW12-S00, LXK2-PW14-U00, LXK2-PW14-V00 LXK2-PM12-R00, LXK2-PM12-S00, LXK2-PM14-U00 LXK2-PE12-Q00, LXK2-PE12-R00, LXK2-PE12-S00, LXK2-PE14-T00, LXK2-PE14-U00 LXK2-PB12-K00, LXK2-PB12-L00, LXK2-PB12-M00, LXK2-PB14-N00, LXK2-PB14-P00, LXK2-PB14-Q00 LXK2-PR12-L00, LXK2-PR12-M00, LXK2-PR14-Q00, LXK2-PR14-R00 LXK2-PD12-Q00, LXK2-PD12-R00, LXK2-PD12-S00 LXK2-PH12-R00, LXK2-PH12-S00 LXK2-PL12-P00, LXK2-PL12-Q00, LXK2-PL12-R00 Source: www.luxeon.com KINGBRIGHT: KA-3528ASYC Source: www.kingbright.com
MPU9250 = invensense:MPU-9250
MPU9250_L MPU9250_R RADIO_PORT = pinhead:PINHD-1X6: PIN HEADER
NC1-NC31 NC33-NC38 = NC:NC: _EXTERNAL_
Q1 = crystal:MC-306: kHz RANGE CRYSTAL UNIT SMD Source: MC-306_405_406_E07X.PDF Homepage <http://www.epsontoyocom.co.jp>; MPN: MC-306 60.0KHZ 100PPM ,12.5PF; OC_FARNELL: 1278040; OC_NEWARK: 31M5576
R1-R42 R44-R46 R48-R54 R56 R61 R62 R64 R1000-R1003 = rcl_upravena:R-EU_: RESISTOR, European symbol
SJ1 SJ2 = jumper:SJ: SMD solder JUMPER
T3 T4 = transistors:NPN
TP3-TP23 = testpad:TP: Test pad
U1 = esp32:ESP-WROOM-32: Espressif Systems ESP-WROOM-32
U3 = um185xx:UM185XX
U$1 = HM-TRP:HM-TRP
U$2 = molex:MOLEX-47219-2001
U$3 = User-Submitted:BMI160: BMI160 Internal Measurement Unit
U$4 = pimoroni-ics:LTR-329ALS-01
U$5 = BMF055:BMF055
X2 = con-coax:SMA-: SMA 50 Ohm End Launch Jack Receptacle - Round Contact Johnson Components Source: www.johnsoncomponents.com .. J502-ND.pdf; MF: JOHNSON COMPONENTS; MPN: 142-0711-821; OC_FARNELL: 1019328; OC_NEWARK: 16F3627
X3 = usb:USB